# EAGLE design breakout_STM32F042F6P6 (EAGLE 7.2.0)
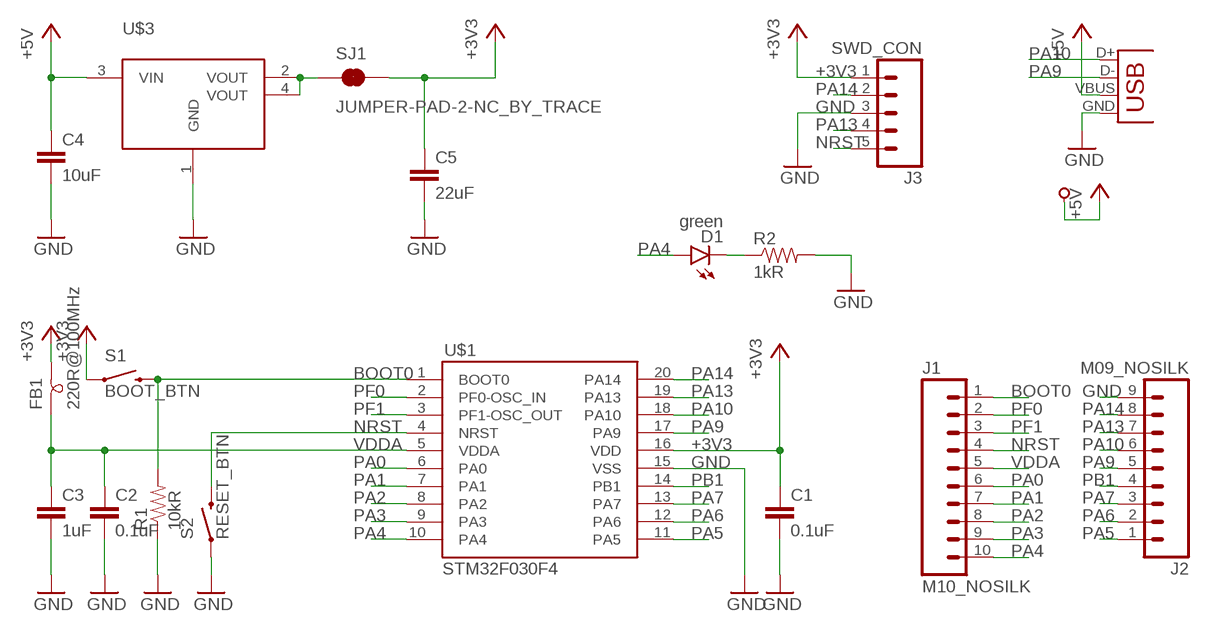
[diagram p0: schematic, sheet 1]

## Parts
C1  0.1uF  CAPACITOR0805  [0805]
C2  0.1uF  CAPACITOR0805  [0805]
C3  1uF  CAPACITOR0805  [0805]
C4  10uF  CAPACITOR0805  [0805]
C5  22uF  CAPACITOR0805  [0805]
D1  green  LED805  [LED-805]
FB1  220R@100MHz  FERRITE-BEAD0805  [0805]
J1  M10_NOSILK  [M10_NOSILK]
J2  M09_NOSILK  [M09_NOSILK]
J3  SWD_CON  M05_NOSILK_1SQ  [M05_NOSILK_1SQ]
JP1  USBSMD  [USB-MINIB]
R1  10kR  RESISTOR0805  [0805]
R2  1kR  RESISTOR0805  [0805]
S1  BOOT_BTN  SWITCH-MOMENTARY-2-SMD-1101NE  [TACTILE-SWITCH-1101NE]
S2  RESET_BTN  SWITCH-MOMENTARY-2-SMD-1101NE  [TACTILE-SWITCH-1101NE]
SJ1  JUMPER-PAD-2-NC_BY_TRACE  [PAD-JUMPER-2-NC_BY_TRACE_YES_SILK]
U$1  STM32F030F4  [TSSOP-20]
U$2  M01_1SQ  [M01_1SQ]
U$3  AMS1117_SOT223  [SOT223]

## Nets
+3V3: C1.1 C5.1 FB1.2 J3.1 S1.1 SJ1.2 U$1.16(VDD)
+5V: C4.1 JP1.VBUS U$2.1 U$3.3(VIN)
BOOT0: J1.1 R1.2 S1.2 U$1.1(BOOT0)
GND: C1.2 C2.2 C3.2 C4.2 C5.2 J2.9 J3.3 JP1.GND R1.1 R2.2 S2.1 U$1.15(VSS) U$3.1(GND)
N$1: SJ1.1 U$3.2(VOUT) U$3.4(VOUT)
N$5: D1.C R2.1
NRST: J1.4 J3.5 S2.2 U$1.4(NRST)
PA0: J1.6 U$1.6(PA0)
PA1: J1.7 U$1.7(PA1)
PA2: J1.8 U$1.8(PA2)
PA3: J1.9 U$1.9(PA3)
PA4: D1.A J1.10 U$1.10(PA4)
PA5: J2.1 U$1.11(PA5)
PA6: J2.2 U$1.12(PA6)
PA7: J2.3 U$1.13(PA7)
PA9: J2.5 JP1.D- U$1.17(PA9)
PA10: J2.6 JP1.D+ U$1.18(PA10)
PA13: J2.7 J3.4 U$1.19(PA13)
PA14: J2.8 J3.2 U$1.20(PA14)
PB1: J2.4 U$1.14(PB1)
PF0: J1.2 U$1.2(PF0-OSC_IN)
PF1: J1.3 U$1.3(PF1-OSC_OUT)
VDDA: C2.1 C3.1 FB1.1 J1.5 U$1.5(VDDA)

## Library data of the parts
C1-C5 = flabbergast:CAPACITOR
D1 = flabbergast:LED: Blue LEDs for production use Various blue LEDs stocked by SparkFun production 0603 - DIO-08575 Rebel - DIO-09553 1206 - DIO-09911
FB1 = flabbergast:FERRITE-BEAD
J1 = flabbergast:M10
J2 = flabbergast:M09
J3 = flabbergast:M05
JP1 = flabbergast:USB: USB Connectors USB-B-PTH is fully proven SKU : PRT-00139/CONN-08278 USB-miniB is fully proven SKU : PRT-00587 USB-A-PCB is untested. USB-A-H is throughly reviewed, but untested. Spark Fun Electronics SKU : PRT-00437 USB-B-SMT is throughly reviewed, but untested. Needs silkscreen touching up. USB-A-S has not been used/tested USB-MB-H has not been used/tested USB-MICROB has been used. CONN-09505; PROD_ID: CONN-08193
R1 R2 = flabbergast:RESISTOR
S1 S2 = SparkFun-Electromechanical:SWITCH-MOMENTARY-2: Various NO switches- pushbuttons, reed, etc
SJ1 = SparkFun-Passives:JUMPER-PAD-2-NC_BY_TRACE
U$1 = flabbergast:STM32F030F4
U$2 = flabbergast:M01
U$3 = flabbergast:AMS1117

## Board
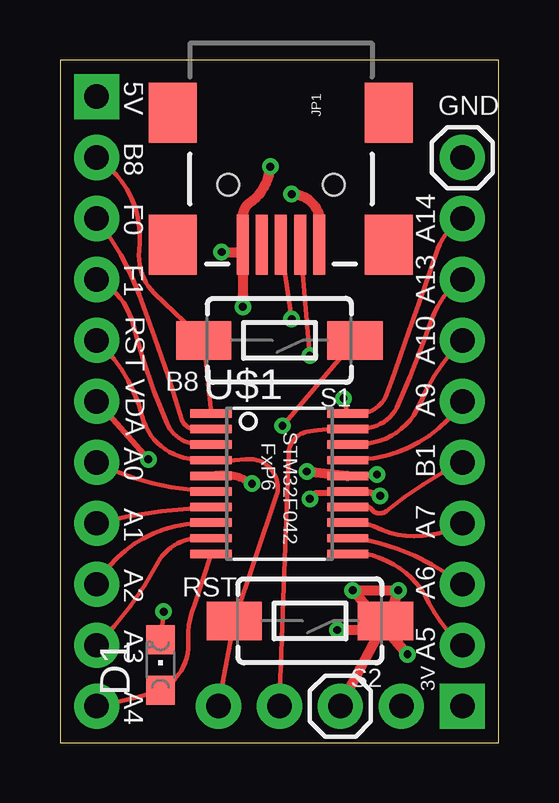
[diagram p1: board, top side]
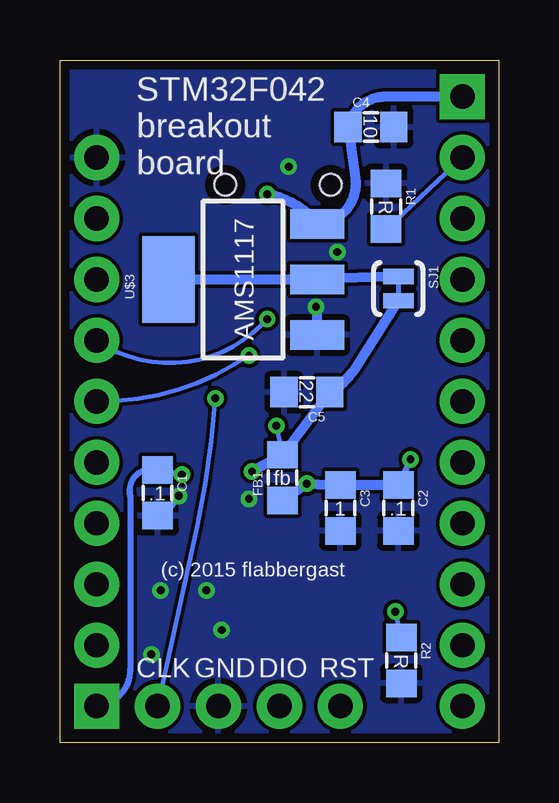
[diagram p2: board, bottom side, seen from below]

Size 18.29 x 28.45 mm. Coordinates in mm from the lower left corner, seen from the top.
Outline: 0,0 18.29,0 18.29,28.45 0,28.45 0,0
Copper layers (1*16): Top 0.0356mm / dielectric 1.5011mm / Bottom 0.0356mm
Design rules "LaenPCBOrder *": minimum track width 6mil, minimum drill 13mil, track to track 6mil, track to pad 6mil, pad to pad 6mil, via to via 6mil, smd to smd 0mil, copper to edge 15mil, drill to drill 6mil, minimum pad ring 7mil, minimum via ring 7mil, stop-mask expansion 3mil, vias tented up to drill 25mil, thermal gap 10mil

### Footprints (pad centres in the part's own frame; a part is rotated, then mirrored left to right if it is on the bottom)
0805 = smd 1.143 x 1.27: 1 -0.953,0; 2 0.953,0
LED-805 = smd 1.2 x 1.2: A 0,-1.05; C 0,1.05
M10_NOSILK = drill 1.016 pad 1.88: 1 -10.16,0; 2 -7.62,0; 3 -5.08,0; 4 -2.54,0; 5 0,0; 6 2.54,0; 7 5.08,0; 8 7.62,0; 9 10.16,0; 10 12.7,0
M09_NOSILK = drill 1.016 pad 1.88: 1 -10.16,0; 2 -7.62,0; 3 -5.08,0; 4 -2.54,0; 5 0,0; 6 2.54,0; 7 5.08,0; 8 7.62,0; 9 10.16,0
M05_NOSILK_1SQ = drill 1.016 pad 1.88 square: 1 -5.08,0 | drill 1.016 pad 1.88: 2 -2.54,0; 3 0,0; 4 2.54,0; 5 5.08,0
USB-MINIB = smd 2.5 x 0.5: D+ 2.5,0; D- 2.5,0.8; GND 2.5,-1.6; ID 2.5,-0.8; VBUS 2.5,1.6 | smd 2.5 x 2: MTN1 -3,4.5; MTN2 2.5,4.5; MTN3 -3,-4.5; MTN4 2.5,-4.5 | hole 0.9: 0,2.2; 0,-2.2
TACTILE-SWITCH-1101NE = smd 2.3 x 1.6: 1 -3.15,0; 2 3.15,0
PAD-JUMPER-2-NC_BY_TRACE_YES_SILK = smd 0.635 x 1.27: 1 -0.508,0; 2 0.508,0
TSSOP-20 = smd 0.35 x 1.727: 1 -2.925,-2.845; 2 -2.275,-2.845; 3 -1.625,-2.845; 4 -0.975,-2.845; 5 -0.325,-2.845; 6 0.325,-2.845; 7 0.975,-2.845; 8 1.625,-2.845; 9 2.275,-2.845; 10 2.925,-2.845; 11 2.925,2.845; 12 2.275,2.845; 13 1.625,2.845; 14 0.975,2.845; 15 0.325,2.845; 16 -0.325,2.845; 17 -0.975,2.845; 18 -1.625,2.845; 19 -2.275,2.845; 20 -2.925,2.845
M01_1SQ = drill 1.016 pad 1.88 square: 1 0,0
SOT223 = smd 1.219 x 2.235: 1 -2.311,-3.099; 2 0,-3.099; 3 2.311,-3.099 | smd 3.6 x 2.2: 4 0,3.099

### Placement (x,y rotation side)
C1  14.22,10.41 270 bottom
C2  4.19,9.78 270 bottom
C3  6.6,9.78 270 bottom
C4  5.33,25.65 0 bottom
C5  8,14.61 180 bottom
D1  4.19,3.24 0 top
FB1  9.02,11.05 90 bottom
J1  1.52,14.22 270 top
J2  16.76,14.22 90 top
J3  11.68,1.52 180 top
JP1  9.21,23.24 270 top
R1  4.7,22.35 270 bottom
R2  4.06,3.43 270 bottom
S1  9.14,16.76 180 top
S2  10.41,5.08 180 top
SJ1  4.19,18.92 270 bottom
U$1  9.14,10.79 270 top
U$2  1.52,26.92 0 top
U$3  10.67,19.3 90 bottom

### Tracks (layer width: path | path; a pad name or v marks a point on that pad's centre or on a via)
+3V3  (via drill 0.33)
  Top 0.178: S1.1 v9.27,13.21
  Top 0.254: U$1.16 v13.21,11.18
  Top 0.406: v10.29,11.3 U$1.16
  Bottom 0.178: v9.27,13.21 FB1.2
  Bottom 0.254: v13.21,11.18 arc14 C1.1 arc-119 15.37,10.29 15.37,3.05 arc85 J3.1
  Bottom 0.406: SJ1.2 5.97,15.62 arc29 C5.1 FB1.2 v10.29,11.3
+5V  (via drill 0.33)
  Top 0.406: JP1.VBUS 10.79,22.03 arc65 9.71,22.86 arc38 v9.65,22.86
  Bottom 0.406: v9.65,22.86 arc43 U$3.3 arc-90 5.97,23.37 C4.1 arc77 4.7,26.92 U$2.1
BOOT0
  Top 0.178: U$1.1 S1.2 3.94,18.73 arc-51 3.3,20.51 arc64 J1.1
  Bottom 0.178: J1.1 R1.2
GND  (via drill 0.33)
  Top 0.229: U$1.15 12.45,10.41
  Top 0.254: 12.45,10.41 arc-43 v13.33,10.29 | v10.41,10.16 10.67,10.41 11.3,10.41
  Top 0.406: JP1.GND v7.62,18.16 | J3.3 S2.1 | 7.62,21.78 7.62,21.84 arc-53 7.87,22.48 arc53 v8.76,24 | v6.73,20.45 7.56,20.45 | v14.48,3.68 13.59,4.7 v14.1,6.35 v12.19,6.35 13.46,4.83 | v11.56,4.7 13.46,4.7
  Bottom 0.254: v13.33,10.29 arc37 C1.2
  Bottom 0.406: v7.62,18.16 U$3.1
  pour Bottom: 0.25,28.19 18.03,28.19 18.03,0.25 0.25,0.25
N$1
  Bottom 0.406: SJ1.1 U$3.2 U$3.4
N$5  (via drill 0.33)
  Top 0.178: D1.C v4.32,5.46
  Bottom 0.178: v4.32,5.46 R2.1
NRST
  Top 0.178: J3.5 S2.2 9.02,10.29 arc114 7.75,11.81 arc-10 U$1.4 5.59,11.81 arc-72 3.43,13.59 arc33 J1.4
PA0
  Top 0.178: U$1.6 5.46,10.54 arc-23 J1.6
PA1
  Top 0.178: U$1.7 5.59,9.78 arc11 J1.7
PA2
  Top 0.178: U$1.8 5.71,9.14 arc57 J1.8
PA3
  Top 0.178: U$1.9 5.71,8.51 arc61 4.06,7.49 arc-17 J1.9
PA4
  Top 0.178: U$1.10 5.59,5.71 arc23 5.33,4.32 arc-69 D1.A arc-8 J1.10
PA5
  Top 0.178: U$1.11 12.7,7.87 arc-55 15.37,5.84 arc22 J2.1
PA6
  Top 0.178: U$1.12 12.57,8.51 arc-25 J2.2
PA7
  Top 0.178: U$1.13 12.57,9.14 arc-13 13.08,9.02 arc58 J2.3
PA9  (via drill 0.33)
  Top 0.178: JP1.D- v10.41,16.13 | U$1.17 12.57,11.81 arc53 J2.5
  Bottom 0.178: v10.41,16.13 11.05,15.75 arc32 J2.5
PA10  (via drill 0.33)
  Top 0.178: JP1.D+ v9.65,17.65 | U$1.18 12.57,12.45 arc65 14.99,14.1 arc-21 J2.6
  Bottom 0.178: v9.65,17.65 9.91,17.4 arc79 J2.6
PA13
  Top 0.178: J3.4 9.53,12.06 arc-77 10.29,12.95 arc-13 U$1.19 12.57,13.08 arc66 14.1,14.1 arc4 15.49,17.65 arc-36 J2.7
PA14  (via drill 0.33)
  Top 0.178: J2.8 arc38 15.75,20.57 arc1 13.97,15.49 arc-3 13.59,14.48 arc-68 12.45,13.72 U$1.20 v11.81,14.35
  Bottom 0.178: J3.2 12.57,9.02 arc-9 v11.81,14.35
PB1
  Top 0.178: U$1.14 12.45,9.78 arc-60 12.95,9.78 arc104 13.59,9.65 arc-12 J2.4
PF0
  Top 0.178: U$1.2 5.59,13.08 arc-72 5.08,13.46 arc3 3.3,18.67 arc17 J1.2
PF1
  Top 0.178: U$1.3 5.71,12.45 arc-66 4.45,13.33 arc-10 3.05,17.4 arc52 J1.3
VDDA  (via drill 0.33)
  Top 0.254: v3.68,11.81 J1.5
  Top 0.33: v8,10.79 arc45 U$1.5
  Bottom 0.254: C2.1 v3.68,11.81
  Bottom 0.406: FB1.1 v8,10.79 arc-5 C3.1 C2.1

### Text on the board
tPlace: 5V | GND | B8 | F0 | A14 | F1 | RST | A13 | VDA | A10 | B8 | STM32F042 / FxP6 | A9 | A0 | B1 | A1 | A7 | A2 | RST | A6 | A3 | A5 | A4 | 3V
bPlace: 10 | STM32F042 / breakout / board | R | AMS1117 | 22 | fb | .1 | .1 | 1 | (c) 2015 flabbergast | R | RST | DIO | GND | CLK